# Altium schematic sheet Power.SchDoc
size A4; Author: Khaled Shahin; SheetNumber: 2; SheetTotal: 6
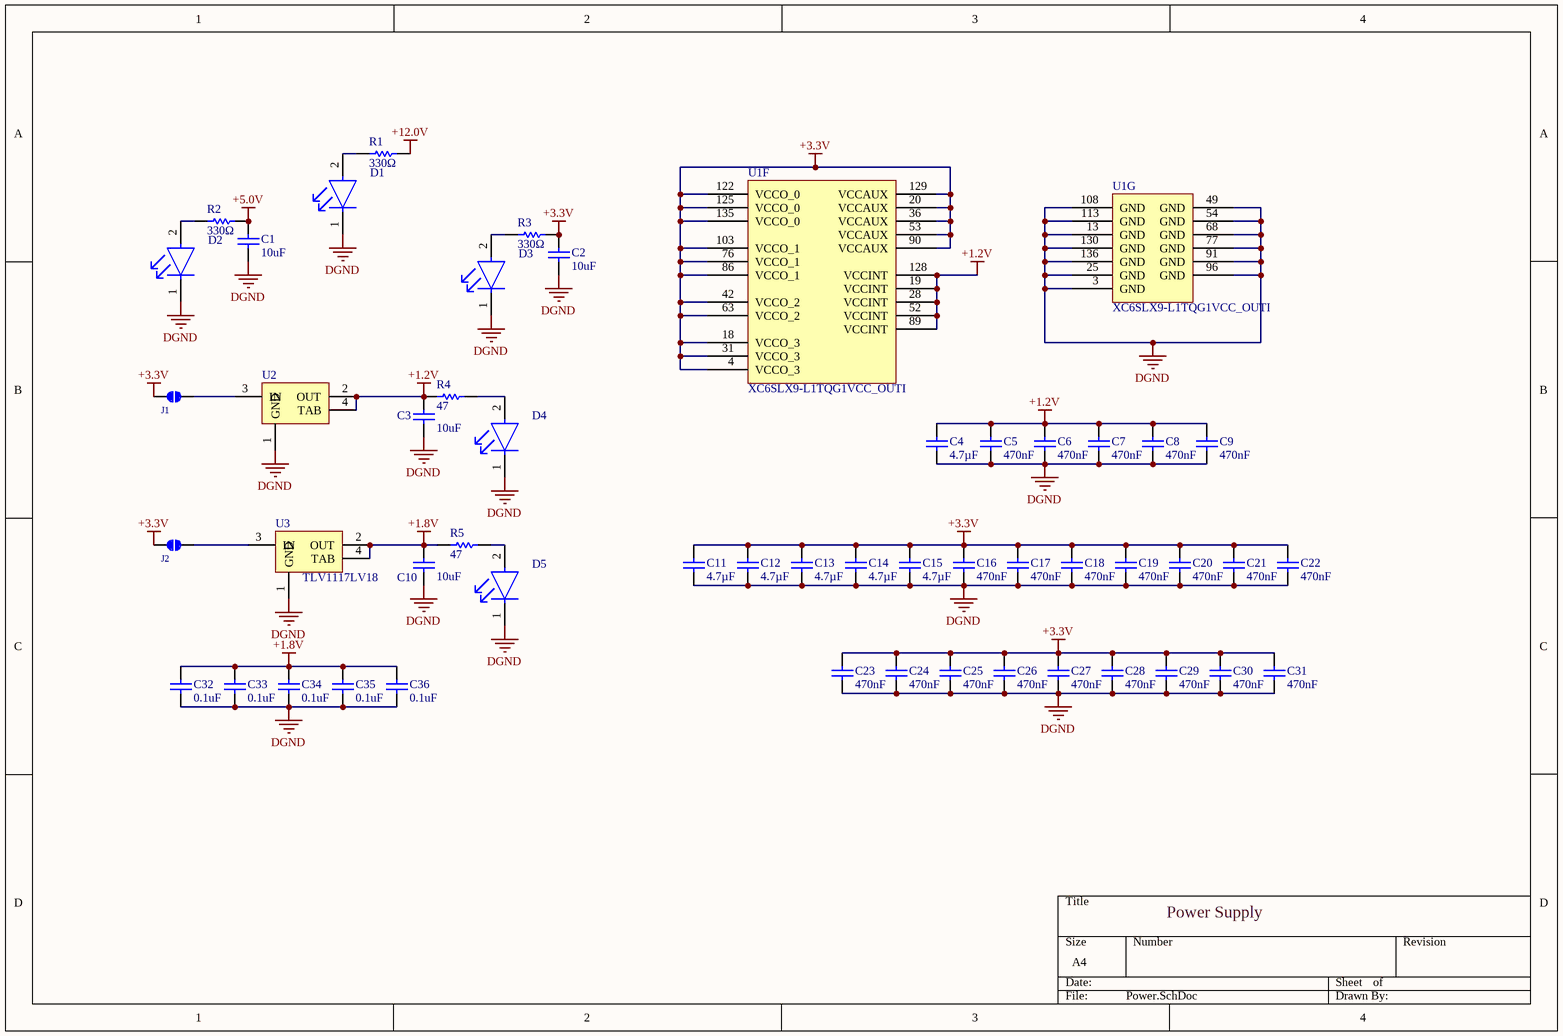
[diagram p0: Power.SchDoc]

## Parts
C1  value 10uF  [capc3216n]  (hidden comment: Cap Semi)
C2  value 10uF  [capc3216n]  (hidden comment: Cap Semi)
C3  value 10uF  [capc3216n]  (hidden comment: Cap Semi)
C4  Capacitance: 4.7µF  [0805CAP]  (hidden comment: Cap_CER_4.7U_25V_0805)
C5  Capacitance: 470nF  [0603CAP]  (hidden comment: CAP CER 0.47UF 10V X7R 0603)
C6  Capacitance: 470nF  [0603CAP]  (hidden comment: CAP CER 0.47UF 10V X7R 0603)
C7  Capacitance: 470nF  [0603CAP]  (hidden comment: CAP CER 0.47UF 10V X7R 0603)
C8  Capacitance: 470nF  [0603CAP]  (hidden comment: CAP CER 0.47UF 10V X7R 0603)
C9  Capacitance: 470nF  [0603CAP]  (hidden comment: CAP CER 0.47UF 10V X7R 0603)
C10  value 10uF  [capc3216n]  (hidden comment: Cap Semi)
C11  Capacitance: 4.7µF  [0805CAP]  (hidden comment: Cap_CER_4.7U_25V_0805)
C12  Capacitance: 4.7µF  [0805CAP]  (hidden comment: Cap_CER_4.7U_25V_0805)
C13  Capacitance: 4.7µF  [0805CAP]  (hidden comment: Cap_CER_4.7U_25V_0805)
C14  Capacitance: 4.7µF  [0805CAP]  (hidden comment: Cap_CER_4.7U_25V_0805)
C15  Capacitance: 4.7µF  [0805CAP]  (hidden comment: Cap_CER_4.7U_25V_0805)
C16  Capacitance: 470nF  [0603CAP]  (hidden comment: CAP CER 0.47UF 10V X7R 0603)
C17  Capacitance: 470nF  [0603CAP]  (hidden comment: CAP CER 0.47UF 10V X7R 0603)
C18  Capacitance: 470nF  [0603CAP]  (hidden comment: CAP CER 0.47UF 10V X7R 0603)
C19  Capacitance: 470nF  [0603CAP]  (hidden comment: CAP CER 0.47UF 10V X7R 0603)
C20  Capacitance: 470nF  [0603CAP]  (hidden comment: CAP CER 0.47UF 10V X7R 0603)
C21  Capacitance: 470nF  [0603CAP]  (hidden comment: CAP CER 0.47UF 10V X7R 0603)
C22  Capacitance: 470nF  [0603CAP]  (hidden comment: CAP CER 0.47UF 10V X7R 0603)
C23  Capacitance: 470nF  [0603CAP]  (hidden comment: CAP CER 0.47UF 10V X7R 0603)
C24  Capacitance: 470nF  [0603CAP]  (hidden comment: CAP CER 0.47UF 10V X7R 0603)
C25  Capacitance: 470nF  [0603CAP]  (hidden comment: CAP CER 0.47UF 10V X7R 0603)
C26  Capacitance: 470nF  [0603CAP]  (hidden comment: CAP CER 0.47UF 10V X7R 0603)
C27  Capacitance: 470nF  [0603CAP]  (hidden comment: CAP CER 0.47UF 10V X7R 0603)
C28  Capacitance: 470nF  [0603CAP]  (hidden comment: CAP CER 0.47UF 10V X7R 0603)
C29  Capacitance: 470nF  [0603CAP]  (hidden comment: CAP CER 0.47UF 10V X7R 0603)
C30  Capacitance: 470nF  [0603CAP]  (hidden comment: CAP CER 0.47UF 10V X7R 0603)
C31  Capacitance: 470nF  [0603CAP]  (hidden comment: CAP CER 0.47UF 10V X7R 0603)
C32  0.1uF  [0805CAP]
C33  0.1uF  [0805CAP]
C34  0.1uF  [0805CAP]
C35  0.1uF  [0805CAP]
C36  0.1uF  [0805CAP]
D1  LED RED CLEAR 2SMD  [ROHM_SML-21_MFG]  (value not drawn)
D2  LED RED CLEAR 2SMD  [ROHM_SML-21_MFG]  (value not drawn)
D3  LED RED CLEAR 2SMD  [ROHM_SML-21_MFG]  (value not drawn)
D4  LED RED CLEAR 2SMD  [ROHM_SML-21_MFG]  (value not drawn)
D5  LED RED CLEAR 2SMD  [ROHM_SML-21_MFG]  (value not drawn)
J1  JUMPER  [SJMP]  (value not drawn)
J2  JUMPER  [SJMP]  (value not drawn)
R1  Resistance: 330Ω  [0603]  (hidden comment: RES_330 Ohm_0603)
R2  Resistance: 330Ω  [0603]  (hidden comment: RES_330 Ohm_0603)
R3  Resistance: 330Ω  [0603]  (hidden comment: RES_330 Ohm_0603)
R4  Resistance (Ohms): 47  [0603RES]  (hidden comment: RES_47R_0.25W_0805)
R5  Resistance (Ohms): 47  [0603RES]  (hidden comment: RES_47R_0.25W_0805)
U1  XC6SLX9-L1TQG1VCC_OUTI  [TQG144_M]  (parts F,G of 7)
U2  IC REG LINEAR 1.2V 1A SOT223-4  [DCY0004A_M]  (value not drawn)
U3  TLV1117LV18  [DCY0004A_M]

## Nets
+1.2V: C3.2 C4.1 C5.1 C6.1 C7.1 C8.1 C9.1 R4.1 U1.19(VCCINT) U1.28(VCCINT) U1.52(VCCINT) U1.89(VCCINT) U1.128(VCCINT) U2.2(OUT) U2.4(TAB)
+1.8V: C10.2 C32.2 C33.2 C34.2 C35.2 C36.2 R5.1 U3.2(OUT) U3.4(TAB)
+3.3V: C2.2 C11.1 C12.1 C13.1 C14.1 C15.1 C16.1 C17.1 C18.1 C19.1 C20.1 C21.1 C22.1 C23.1 C24.1 C25.1 C26.1 C27.1 C28.1 C29.1 C30.1 C31.1 J1.1 J2.1 R3.2 U1.4(VCCO_3) U1.18(VCCO_3) U1.20(VCCAUX) U1.31(VCCO_3) U1.36(VCCAUX) U1.42(VCCO_2) U1.53(VCCAUX) U1.63(VCCO_2) U1.76(VCCO_1) U1.86(VCCO_1) U1.90(VCCAUX) U1.103(VCCO_1) U1.122(VCCO_0) U1.125(VCCO_0) U1.129(VCCAUX) U1.135(VCCO_0)
+5.0V: C1.2 R2.2
+12.0V: R1.2
DGND: C1.1 C2.1 C3.1 C4.2 C5.2 C6.2 C7.2 C8.2 C9.2 C10.1 C11.2 C12.2 C13.2 C14.2 C15.2 C16.2 C17.2 C18.2 C19.2 C20.2 C21.2 C22.2 C23.2 C24.2 C25.2 C26.2 C27.2 C28.2 C29.2 C30.2 C31.2 C32.1 C33.1 C34.1 C35.1 C36.1 D1.1(C) D2.1(C) D3.1(C) D4.1(C) D5.1(C) U1.3(GND) U1.13(GND) U1.25(GND) U1.49(GND) U1.54(GND) U1.68(GND) U1.77(GND) U1.91(GND) U1.96(GND) U1.108(GND) U1.113(GND) U1.130(GND) U1.136(GND) U2.1(GND) U3.1(GND)
NetD1_2: D1.2(A) R1.1
NetD2_2: D2.2(A) R2.1
NetD3_2: D3.2(A) R3.1
NetD4_2: D4.2(A) R4.2
NetD5_2: D5.2(A) R5.2
NetJ1_2: J1.2 U2.3(IN)
NetJ2_2: J2.2 U3.3(IN)

## Notes on the sheet
- Power Supply

## Library data of the parts
C1-C3 C10 = Cap_CER_10U_10V_1206: Capacitor; PackageReference: C0805; PackageDescription: Chip Capacitor; Supplier 1: Digi-Key; Supplier Part Number 1: 587-2596-1-ND
C4 C11-C15 = Cap_CER_4.7U_25V_0805: CAP CER 4.7UF 25V X7R 0805; Manufacturer: TDK Corporation; Manufacturer Part Number: C2012X7R1E475K125AB; Tolerance: ±10%; Supplier 1: Digi-Key; RoHS: RoHS Compliant; Category: Capacitors; Stock 1: 129176; Pricing 1: 1=0.45, 10=0.392, 100=0.196, 250=0.1568, 500=0.1428, 1000=0.1288 (USD); Packaging: Cut Tape (CT); Part Status: Active; Voltage - Rated: 25V; Temperature Coefficient: X7R; Operating Temperature: -55°C ~ 125°C; Features: Low ESL; Ratings: -; Applications: General Purpose; Failure Rate: -; Mounting Type: Surface Mount, MLCC; Package / Case: 0805 (2012 Metric); Size / Dimension: 0.079" L x 0.049" W (2.00mm x 1.25mm); Height - Seated (Max): -; Thickness (Max): 0.057" (1.45mm); Lead Spacing: -; Lead Style: -; ComponentLink1URL: https://product.tdk.com/info/en/catalog/datasheets/mlcc_commercial_general_en.pdf; ComponentLink1Description: https://product.tdk.com/info/en/catalog/datasheets/mlcc_commercial_general_en.pdf; Supplier Part Number 1: 445-5972-1-ND
C5-C9 C16-C31 = Cap_CER_0.47U_10V_0603: 0.47µF ±10% 10V Ceramic Capacitor X7R 0603 (1608 Metric); Manufacturer: KEMET; Manufacturer Part Number: C0603C474K8RACTU; Dissipation Factor: 5%; ComponentLink1URL: http://ds.yuden.co.jp/TYCOMPAS/ut/detail.do?productNo=LMK107B7105KA-T&fileName=LMK107B7105KA-T_SS&mode=specSheetDownload; ComponentLink1Description: http://ds.yuden.co.jp/TYCOMPAS/ut/detail.do?productNo=LMK107B7105KA-T&fileName=LMK107B7105KA-T_SS&mode=specSheetDownload; Supplier 1: Digi-Key; RoHS: Yes; Stock 1: 60616; Pricing 1: 1 = 0.42000, 10 = 0.29500, 100 = 0.19410, 500 = 0.14376, 1000 = 0.12220 (USD); Mount: Surface Mount,PCB; Case/Package: 0603; Case Code (Metric): 1608; Case Code (Imperial): 0603; Dielectric Material: Ceramic; Min Operating Temperature: -55°C; Max Operating Temperature: 125°C; Tolerance: 10%; Packaging: Tape and Reel; Voltage Rating (DC): 10V; Dielectric: X7R; Package Quantity: 1; Voltage Rating: 10V; Termination: SMD/SMT; Voltage: 10V; Length: 1.6mm; Height: 0.8mm; Width: 0.031inch; Depth: 0.8mm; Thickness: 0.034inch; Lead Pitch: 0.7mm; Radiation Hardening: No; REACH SVHC: No SVHC; ComponentLink2URL: https://datasheet.ciiva.com/18193/getdatasheetpartid-650342-18193126.pdf?src-supplier=Verical; ComponentLink2Description: https://datasheet.ciiva.com/18193/getdatasheetpartid-650342-18193126.pdf?src-supplier=Verical; ComponentLink3URL: https://datasheet.ciiva.com/14595/70095383-14595897.pdf?src-supplier=Allied+Electronics; ComponentLink3Description: https://datasheet.ciiva.com/14595/70095383-14595897.pdf?src-supplier=Allied+Electronics; ComponentLink4URL: https://datasheet.ciiva.com/5418/kem-c1002-x7r-smd-5418063.pdf?src-supplier=Mouser; ComponentLink4Description: https://datasheet.ciiva.com/5418/kem-c1002-x7r-smd-5418063.pdf?src-supplier=Mouser; Supplier Part Number 1: 399-4923-1-ND; Supplier 2: Digi-Key; Supplier Part Number 2: 399-C0603C474K8RAC7867CT-ND
C32-C36 = CAP_CER_0.1uf_10V_0805: Surface Mount Ceramic Multilayer Capacitor 0.1uF 10% X7R 16V 0805 Paper T/R; Manufacturer: Yageo; Manufacturer Part Number: CC0805KRX7R7BB104; Capacitance: 100nF; Insulation Resistance: 100GR; Supplier 1: Digi-Key; RoHS: Yes; Category: Ceramic Capacitors; Pricing 1: 1=0.12000, 10=0.08400, 50=0.04760, 100=0.03950, 500=0.02768, 1000=0.02291 (USD); Mount: Surface Mount; Case/Package: 0805; Number of Pins: 2; Case Code (Metric): 2012; Case Code (Imperial): 0805; Min Operating Temperature: -55°C; Max Operating Temperature: 125°C; Tolerance: 10%; Voltage Rating: 16V; Voltage Rating (DC): 16V; Packaging: Tape and Reel; Package Quantity: 1; Dielectric: X7R; Termination: SMD/SMT; Resistor Type: Ceramic; Voltage: 16V; Series: CC; Length: 2mm; Width: 0.049inch; Height: 0.85mm; Thickness: 0.033inch; Depth: 1.25mm; Radiation Hardening: No; REACH SVHC: No SVHC; Lead Free: Lead Free; Halogen Free: Halogen Free; RoHS Compliant: Yes; ComponentLink1URL: https://datasheet.ciiva.com/8034/1784427-8034017.pdf?src-supplier=Element14; ComponentLink1Description: https://datasheet.ciiva.com/8034/1784427-8034017.pdf?src-supplier=Element14; ComponentLink2URL: https://datasheet.ciiva.com/11786/0900766b80d84f1d-11786102.pdf?src-supplier=RSComponents; ComponentLink2Description: https://datasheet.ciiva.com/11786/0900766b80d84f1d-11786102.pdf?src-supplier=RSComponents; ComponentLink3URL: https://datasheet.ciiva.com/7978/1489800-7978204.pdf?src-supplier=Element14; ComponentLink3Description: https://datasheet.ciiva.com/7978/1489800-7978204.pdf?src-supplier=Element14; ComponentLink4URL: https://datasheet.ciiva.com/144/mlccorderingcode-144999.pdf?src-supplier=Digi-Key; ComponentLink4Description: https://datasheet.ciiva.com/144/mlccorderingcode-144999.pdf?src-supplier=Digi-Key; ComponentLink5URL: https://datasheet.ciiva.com/144/mlccorderingcode-144998.pdf?src-supplier=Digi-Key; ComponentLink5Description: https://datasheet.ciiva.com/144/mlccorderingcode-144998.pdf?src-supplier=Digi-Key; ComponentLink6URL: https://datasheet.ciiva.com/145/mlccorderingcode-145000.pdf?src-supplier=Digi-Key; ComponentLink6Description: https://datasheet.ciiva.com/145/mlccorderingcode-145000.pdf?src-supplier=Digi-Key; ComponentLink7URL: https://datasheet.ciiva.com/8034/1784427-8034015.pdf?src-supplier=Element14; ComponentLink7Description: https://datasheet.ciiva.com/8034/1784427-8034015.pdf?src-supplier=Element14; ComponentLink8URL: https://datasheet.ciiva.com/11465/upy-gphc-x7r-6-3v-to-50v-8-11465289.pdf?src-supplier=Avnet; ComponentLink8Description: https://datasheet.ciiva.com/11465/upy-gphc-x7r-6-3v-to-50v-8-11465289.pdf?src-supplier=Avnet; ComponentLink9URL: https://datasheet.ciiva.com/15189/getdatasheetpartid-314877-15189221.pdf?src-supplier=Verical; ComponentLink9Description: https://datasheet.ciiva.com/15189/getdatasheetpartid-314877-15189221.pdf?src-supplier=Verical; Supplier Part Number 1: 311-1142-1-ND
D1-D5 = APT2012LSECK/J3-PRV: Red 625nm LED Indication - Discrete 1.8V 0805 (2012 Metric); Manufacturer: Kingbright; Lens Color: Colorless; Luminous Intensity: 40mcd; Test Current: 2mA; Viewing Angle: 120°; Supplier 1: Digi-Key; Manufacturer Part Number: APT2012LSECK/J3-PRV; RoHS: Yes; Category: LEDs; Stock 1: 47256; Pricing 1: 1=0.68000, 10=0.41600, 100=0.23890, 1000=0.18698 (USD); Mount: Surface Mount; Case/Package: 0805; Color: Red; Case Code (Metric): 2012; Case Code (Imperial): 0805; Packaging: Tape and Reel; Lens Transparency: Clear; Dominant Wavelength: 625nm; Forward Voltage: 1.8V; Length: 2mm; Width: 1.25mm; Height: 0.75mm; RoHS Compliant: Yes; ComponentLink1URL: http://www.mouser.com/ds/2/216/APT2012LSECK-J3-PRV-535674.pdf?src-supplier=Mouser; ComponentLink1Description: http://www.mouser.com/ds/2/216/APT2012LSECK-J3-PRV-535674.pdf?src-supplier=Mouser; ComponentLink2URL: http://www.kingbrightusa.com/images/catalog/SPEC/APT2012LSECK-J3-PRV.pdf?src-supplier=Digi-Key; ComponentLink2Description: http://www.kingbrightusa.com/images/catalog/SPEC/APT2012LSECK-J3-PRV.pdf?src-supplier=Digi-Key; Supplier Part Number 1: 754-1935-1-ND
J1 J2 = JUMPER: OPTION SELECTION PAD; Supplier 1: Digi-Key
R1-R3 = RES_330 Ohm_0603: Res Thick Film 0603 330 Ohm 5% 0.1W(1/10W) +/-200ppm/ßC Pad SMD Automotive T/R; Manufacturer: Panasonic; Manufacturer Part Number: ERJ-3GEYJ331V; Power Rating: 100mW; Voltage Rating: 75V; Temperature Coefficient: 200ppm/°C; Voltage Rating (DC): 50V; Supplier 1: Digi-Key; RoHS: Yes; Stock 1: 2750454; Pricing 1: 1 = 0.10000, 10 = 0.05400, 100 = 0.02190, 1000 = 0.00985, 2500 = 0.00855 (USD); Mount: Surface Mount; Case/Package: 0603; Weight: 7.1E-05oz; Case Code (Metric): 1608; Case Code (Imperial): 0603; Contact Plating: Tin; Min Operating Temperature: -55°C; Max Operating Temperature: 155°C; Tolerance: 5%; Packaging: Tape and Reel; Package Quantity: 1; Composition: Thick Film; Number of Terminations: 2; Termination: SMD/SMT; Military Standard: Not; Max Power Dissipation: 100mW; Features: Automotive AEC-Q200; Length: 1.6mm; Height: 0.45mm; Width: 0.031inch; Depth: 0.8mm; Radiation Hardening: No; REACH SVHC: No SVHC; Lead Free: Lead Free; ComponentLink1URL: https://datasheet.ciiva.com/34303/1988727-34303616.pdf?src-supplier=Jameco; ComponentLink1Description: https://datasheet.ciiva.com/34303/1988727-34303616.pdf?src-supplier=Jameco; ComponentLink2URL: https://datasheet.ciiva.com/11821/0900766b80f806dd-11821444.pdf?src-supplier=RSComponents; ComponentLink2Description: https://datasheet.ciiva.com/11821/0900766b80f806dd-11821444.pdf?src-supplier=RSComponents; ComponentLink3URL: https://datasheet.ciiva.com/9117/aoa0000ce1-9117173.pdf?src-supplier=Avnet; ComponentLink3Description: https://datasheet.ciiva.com/9117/aoa0000ce1-9117173.pdf?src-supplier=Avnet; ComponentLink4URL: https://datasheet.ciiva.com/16767/70255313-16767749.pdf?src-supplier=Allied+Electronics; ComponentLink4Description: https://datasheet.ciiva.com/16767/70255313-16767749.pdf?src-supplier=Allied+Electronics; ComponentLink5URL: https://datasheet.ciiva.com/15159/getdatasheetpartid-29203-15159270.pdf?src-supplier=Verical; ComponentLink5Description: https://datasheet.ciiva.com/15159/getdatasheetpartid-29203-15159270.pdf?src-supplier=Verical; ComponentLink6URL: https://datasheet.ciiva.com/28673/1678796-28673994.pdf?src-supplier=Element14; ComponentLink6Description: https://datasheet.ciiva.com/28673/1678796-28673994.pdf?src-supplier=Element14; ComponentLink7URL: https://datasheet.ciiva.com/6138/1500035-6138716.pdf?src-supplier=Farnell; ComponentLink7Description: https://datasheet.ciiva.com/6138/1500035-6138716.pdf?src-supplier=Farnell; ComponentLink8URL: https://datasheet.ciiva.com/46381/1500035-46381164.pdf?src-supplier=Element14; ComponentLink8Description: https://datasheet.ciiva.com/46381/1500035-46381164.pdf?src-supplier=Element14; ComponentLink9URL: https://datasheet.ciiva.com/16449/aoa0000ce1-16449005.pdf?src-supplier=Future+Electronics; ComponentLink9Description: https://datasheet.ciiva.com/16449/aoa0000ce1-16449005.pdf?src-supplier=Future+Electronics; Supplier Part Number 1: P330GCT-ND
R4 R5 = RES_47R_0.25W_0805: RES SMD 47 OHM 5% 0.4W 0805; Manufacturer: Rohm Semiconductor; Manufacturer Part Number: ESR10EZPJ470; Temperature Coefficient: ±200ppm/°C; Supplier 1: Digi-Key; RoHS: RoHS Compliant; Category: Resistors; Stock 1: 17932; Pricing 1: 1=0.11, 10=0.098, 100=0.0378, 1000=0.01664, 2500=0.01437 (USD); Packaging: Cut Tape (CT); Part Status: Active; Tolerance: ±5%; Power (Watts): 0.4W; Composition: Thick Film; Features: Automotive AEC-Q200, Pulse Withstanding; Operating Temperature: -55°C ~ 155°C; Package / Case: 0805 (2012 Metric); Supplier Device Package: 0805; Size / Dimension: 0.079" L x 0.049" W (2.00mm x 1.25mm); Height - Seated (Max): 0.026" (0.65mm); Failure Rate: -; ComponentLink1URL: http://www.rohm.com/web/global/datasheet/ESR01MZPF/esr-e; ComponentLink1Description: http://www.rohm.com/web/global/datasheet/ESR01MZPF/esr-e; Supplier Part Number 1: RHM47KCT-ND
U1 = XC6SLX9-L1TQG144I: Spartan-6 LX 1.0V FPGA, 102 User I/Os, 144-Pin TQFP (0.5mm Pitch), Low Power Version, Industrial Grade, Pb-Free; Published: 17-Nov-2009; DatasheetVersion: ver1.6, Nov-2010; PackageVersion: ver1.2, Jun-2004; PackageReference: TQG144; Publisher: Altium Limited; PackageDescription: 144-Pin Thin Quad Flat Pack (TQG144) - Pb-Free; Code_JEDEC: MS-026-BFB; ComponentLink1Description: Manufacturer Link; ComponentLink1URL: http://www.xilinx.com; ComponentLink2Description: Spartan-6 Datasheet; ComponentLink2URL: http://www.xilinx.com/support/documentation/data_sheets/ds160.pdf; ComponentLink3Description: Spartan-6 Documents; ComponentLink3URL: http://www.xilinx.com/support/documentation/spartan-6.htm; ComponentLink4Description: Xilinx.com Home; ComponentLink4URL: http://www.xilinx.com; Supplier 1: Digi-Key; Supplier Part Number 1: 122-1779-ND
U2 = TLV1117LV12DCYR: Linear Voltage Regulator IC Positive Fixed 1 Output 1.2V 1A SOT-223-4; Manufacturer: Texas Instruments; Number of Outputs: 1; Max Power Dissipation: 1.59W; Dropout Voltage: 570mV; Max Input Voltage: 5.5V; Min Input Voltage: 2V; Min Current Limit: 1.1A; Quiescent Current: 50uA; Accuracy: 2%; Supplier 1: Digi-Key; Manufacturer Part Number: TLV1117LV12DCYR; RoHS: Yes; Category: Voltage Regulators - Linear; Pricing 1: 1=0.49000, 10=0.41700, 25=0.38960, 100=0.31160, 250=0.28936, 500=0.24486, 1000=0.18921 (USD); Case/Package: SOT-223; Number of Pins: 4; Contact Plating: Tin; Min Operating Temperature: -40°C; Max Operating Temperature: 125°C; Output Voltage: 1.2V; Packaging: Tape and Reel; Output Current: 1A; Package Quantity: 1; Max Output Current: 1A; Number of Regulators: 1; Polarity: Positive; Power Dissipation: 1.59W; Nominal Output Voltage: 1.2V; Power Rating: 1.59W; Min Output Voltage: 1.2V; Max Output Voltage: 1.2V; Output Type: Fixed; Series: -; Length: 6.7mm; Width: 3.7mm; Height: 1.7mm; Radiation Hardening: No; REACH SVHC: No SVHC; Lead Free: Lead Free; RoHS Compliant: Yes; ComponentLink1URL: http://components.arrow.com/part/dataview/51117909S8954704N7713?src-supplier=Arrow+Electronics; ComponentLink1Description: http://components.arrow.com/part/dataview/51117909S8954704N7713?src-supplier=Arrow+Electronics; ComponentLink2URL: http://www.ti.com/general/docs/lit/getliterature.tsp?genericPartNumber=TLV1117LV&amp;&amp;fileType=pdf&src-supplier=Farnell; ComponentLink2Description: http://www.ti.com/general/docs/lit/getliterature.tsp?genericPartNumber=TLV1117LV&amp;&amp;fileType=pdf&src-supplier=Farnell; ComponentLink3URL: http://www.ti.com/general/docs/lit/getliterature.tsp?genericPartNumber=TLV1117LV&&fileType=pdf&src-supplier=Element14; ComponentLink3Description: http://www.ti.com/general/docs/lit/getliterature.tsp?genericPartNumber=TLV1117LV&&fileType=pdf&src-supplier=Element14; ComponentLink4URL: http://www.ti.com/general/docs/lit/getliterature.tsp?genericPartNumber=TLV1117LV&&fileType=pdf&src-supplier=Farnell; ComponentLink4Description: http://www.ti.com/general/docs/lit/getliterature.tsp?genericPartNumber=TLV1117LV&&fileType=pdf&src-supplier=Farnell; ComponentLink5URL: http://www.ti.com/lit/ds/symlink/tlv1117lv.pdf?src-supplier=Digi-Key; ComponentLink5Description: http://www.ti.com/lit/ds/symlink/tlv1117lv.pdf?src-supplier=Digi-Key; ComponentLink6URL: http://www.ti.com/general/docs/lit/getliterature.tsp?genericPartNumber=TLV1117LV&amp;&amp;fileType=pdf&src-supplier=Newark; ComponentLink6Description: http://www.ti.com/general/docs/lit/getliterature.tsp?genericPartNumber=TLV1117LV&amp;&amp;fileType=pdf&src-supplier=Newark; ComponentLink7URL: http://www.farnell.com/datasheets/1888875.pdf?src-supplier=Newark; ComponentLink7Description: http://www.farnell.com/datasheets/1888875.pdf?src-supplier=Newark; ComponentLink8URL: http://www.ti.com/lit/gpn/tlv1117lv?src-supplier=Mouser; ComponentLink8Description: http://www.ti.com/lit/gpn/tlv1117lv?src-supplier=Mouser; ComponentLink9URL: http://www.ti.com/general/docs/lit/getliterature.tsp?genericPartNumber=TLV1117LV&&fileType=pdf&src-supplier=Avnet; ComponentLink9Description: http://www.ti.com/general/docs/lit/getliterature.tsp?genericPartNumber=TLV1117LV&&fileType=pdf&src-supplier=Avnet; Supplier Part Number 1: 296-28776-1-ND
U3 = TLV1117LV18: 1A Low-Dropout Linear Regulator, 4-pin SOT-223; Manufacturer: Texas Instruments; Manufacturer Part Number: TLV1117LV18DCYR; Regulator Topology: Positive Fixed; Voltage - Output: 1.8V; Voltage - Dropout (Typical): 0.57V @ 1A; Number of Regulators: 1; Voltage - Input: Up to 5.5V; Current - Limit (Min): 1.1A; Supplier 1: Digi-Key; RoHS: RoHS Compliant; Category: Integrated Circuits (ICs); Stock 1: 9602; Pricing 1: 1=0.64, 10=0.564, 100=0.4316, 500=0.34196, 1000=0.2739 (USD); Packaging: Digi-Reel®; Part Status: Active; Current - Output: 1A; Operating Temperature: -40°C ~ 125°C; Mounting Type: Surface Mount; Package / Case: TO-261-4, TO-261AA; Supplier Device Package: SOT-223-4; ComponentLink1URL: http://www.ti.com/lit/ds/symlink/tlv1117lv.pdf; ComponentLink1Description: http://www.ti.com/lit/ds/symlink/tlv1117lv.pdf; Supplier Part Number 1: 296-28777-6-ND